# Altium project board2.PrjPcb
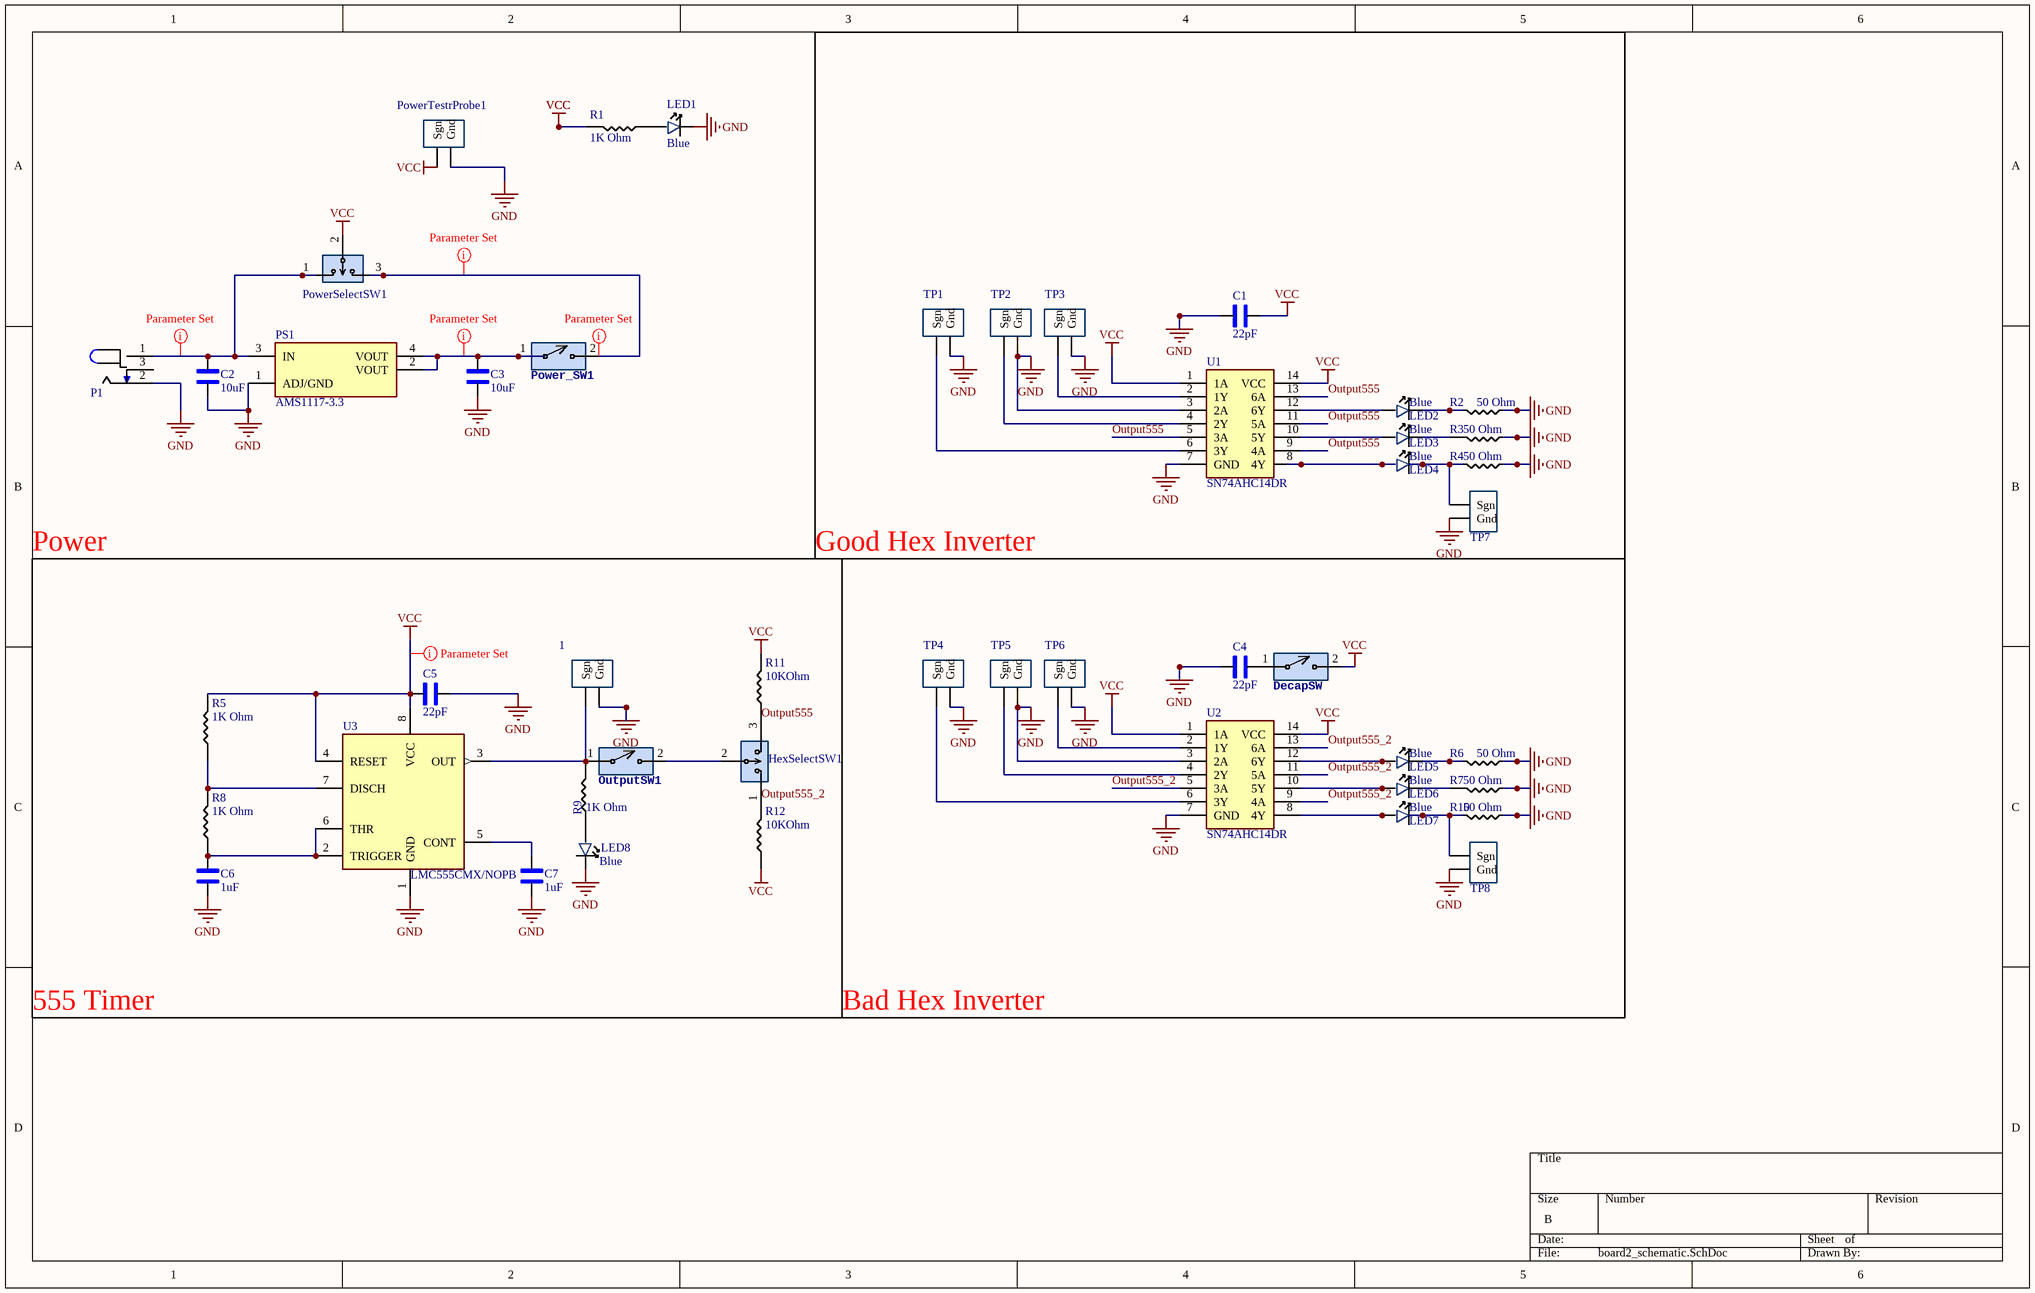
[diagram p0: board2_schematic.SchDoc]
1 sheet, 47 parts. Net scope: global (net labels, ports and power ports of the same name join across sheets).
Board file: board2_pcb.PcbDoc

## Sheet board2_schematic.SchDoc: Good/Bad Layout
size B; Author: Parth; CompanyName: CU boulder; DrawnBy: Parth; Revision: 1.0; SheetNumber: 1; SheetTotal: 1

### Parts
1  10x Probe TP  [TP10x_Probe]  (value not drawn)
C1  22pF  [1206_Passive_Capacitor]
C2  10uF  [1206_Passive_Capacitor]
C3  10uF  [1206_Passive_Capacitor]
C4  22pF  [1206_Passive_Capacitor]
C5  22pF  [1206_Passive_Capacitor]
C6  1uF  [1206_Passive_Capacitor]
C7  1uF  [1206_Passive_Capacitor]
DecapSW  SW_2Pin_100mil_Switch  [2Pin-Header-Conn]  (value not drawn)
HexSelectSW1  PREC003SAAN-RC  [3_PIN_100mil]  (value not drawn)
LED1  Blue  [LED_1206]
LED2  Blue  [LED_1206]
LED3  Blue  [LED_1206]
LED4  Blue  [LED_1206]
LED5  Blue  [LED_1206]
LED6  Blue  [LED_1206]
LED7  Blue  [LED_1206]
LED8  Blue  [LED_1206]
OutputSW1  SW_2Pin_100mil_Switch  [2Pin-Header-Conn]  (value not drawn)
P1  Power Jack  [Power_Jack]  (value not drawn)
Power_SW1  SW_2Pin_100mil_Switch  [2Pin-Header-Conn]  (value not drawn)
PowerSelectSW1  PREC003SAAN-RC  [3_PIN_100mil]  (value not drawn)
PowerTestrProbe1  10x Probe TP  [TP10x_Probe]  (value not drawn)
PS1  AMS1117-3.3  [LDO]
R1  value 1K Ohm  [1206_Passive_Resitor]  (hidden comment: 1k)
R2  value 50 Ohm  [1206_Passive_Resitor]  (hidden comment: 50R)
R3  value 50 Ohm  [1206_Passive_Resitor]  (hidden comment: 50R)
R4  value 50 Ohm  [1206_Passive_Resitor]  (hidden comment: 50R)
R5  value 1K Ohm  [1206_Passive_Resitor]  (hidden comment: 1k)
R6  value 50 Ohm  [1206_Passive_Resitor]  (hidden comment: 50R)
R7  value 50 Ohm  [1206_Passive_Resitor]  (hidden comment: 50R)
R8  value 1K Ohm  [1206_Passive_Resitor]  (hidden comment: 1k)
R9  value 1K Ohm  [1206_Passive_Resitor]  (hidden comment: 1k)
R10  value 50 Ohm  [1206_Passive_Resitor]  (hidden comment: 50R)
R11  value 10KOhm  [1206_Passive_Resitor]  (hidden comment: 10k)
R12  value 10KOhm  [1206_Passive_Resitor]  (hidden comment: 10k)
TP1  10x Probe TP  [TP10x_Probe]  (value not drawn)
TP2  10x Probe TP  [TP10x_Probe]  (value not drawn)
TP3  10x Probe TP  [TP10x_Probe]  (value not drawn)
TP4  10x Probe TP  [TP10x_Probe]  (value not drawn)
TP5  10x Probe TP  [TP10x_Probe]  (value not drawn)
TP6  10x Probe TP  [TP10x_Probe]  (value not drawn)
TP7  10x Probe TP  [TP10x_Probe]  (value not drawn)
TP8  10x Probe TP  [TP10x_Probe]  (value not drawn)
U1  SN74AHC14DR  [HEX_74AC14]
U2  SN74AHC14DR  [HEX_74AC14]
U3  LMC555CMX/NOPB  [TS555IDTTR]

### Nets
GND: 1.2(Gnd) C1.1 C2.1 C3.1 C4.1 C5.2 C6.1 C7.1 LED1.2 LED8.2 P1.2 PowerTestrProbe1.2(Gnd) PS1.1(ADJ/GND) R2.1 R3.1 R4.1 R6.1 R7.1 R10.1 TP1.2(Gnd) TP2.2(Gnd) TP3.2(Gnd) TP4.2(Gnd) TP5.2(Gnd) TP6.2(Gnd) TP7.2(Gnd) TP8.2(Gnd) U1.3(2A) U1.7(GND) U2.3(2A) U2.7(GND) U3.1(GND)
VCC: C1.2 C5.1 DecapSW.2 PowerSelectSW1.2 PowerTestrProbe1.1(Sgn) R1.2 R5.2 R11.2 R12.1 U1.1(1A) U1.14(VCC) U2.1(1A) U2.14(VCC) U3.4(RESET) U3.8(VCC)
Output555: HexSelectSW1.3 R11.1 U1.5(3A) U1.9(4A) U1.11(5A) U1.13(6A)
Output555_2: HexSelectSW1.1 R12.2 U2.5(3A) U2.9(4A) U2.11(5A) U2.13(6A)
Net1_1: 1.1(Sgn) OutputSW1.1 R9.2 U3.3(OUT)
NetC2_2: C2.2 P1.1 PowerSelectSW1.1 PS1.3(IN)
NetC3_2: C3.2 Power_SW1.1 PS1.2(VOUT) PS1.4(VOUT)
NetC4_2: C4.2 DecapSW.1
NetC6_2: C6.2 R8.1 U3.2(TRIGGER) U3.6(THR)
NetC7_2: C7.2 U3.5(CONT)
NetHexSelectSW1_2: HexSelectSW1.2 OutputSW1.2
NetLED1_1: LED1.1 R1.1
NetLED2_1: LED2.1 U1.12(6Y)
NetLED2_2: LED2.2 R2.2
NetLED3_1: LED3.1 U1.10(5Y)
NetLED3_2: LED3.2 R3.2
NetLED4_1: LED4.1 U1.8(4Y)
NetLED4_2: LED4.2 R4.2 TP7.1(Sgn)
NetLED5_1: LED5.1 U2.12(6Y)
NetLED5_2: LED5.2 R6.2
NetLED6_1: LED6.1 U2.10(5Y)
NetLED6_2: LED6.2 R7.2
NetLED7_1: LED7.1 U2.8(4Y)
NetLED7_2: LED7.2 R10.2 TP8.1(Sgn)
NetLED8_1: LED8.1 R9.1
NetPower_SW1_2: Power_SW1.2 PowerSelectSW1.3
NetR5_1: R5.1 R8.2 U3.7(DISCH)
NetTP1_1: TP1.1(Sgn) U1.6(3Y)
NetTP2_1: TP2.1(Sgn) U1.4(2Y)
NetTP3_1: TP3.1(Sgn) U1.2(1Y)
NetTP4_1: TP4.1(Sgn) U2.6(3Y)
NetTP5_1: TP5.1(Sgn) U2.4(2Y)
NetTP6_1: TP6.1(Sgn) U2.2(1Y)

Not connected (* = marked no-connect by the designer): P1 3

### Layout directives
rule Width Constraint [Pref Width = 20mil    Min Width = 10mil    Max Width = 30mil]: NetC2_2, NetC3_2, NetPower_SW1_2, VCC

### Notes on the sheet
- Power
- Good Hex Inverter
- 555 Timer
- Bad Hex Inverter

### Library data of the parts
1 PowerTestrProbe1 TP1-TP8 = TP_10x_Probe: Test Point 300 mil centers
C1 C4 C5 = C_22pF_1206: 22pF ±5% 1kV C0G 1206 Multilayer Ceramic Capacitors MLCC - SMD/SMT RoHS; MFR Part #: CC1206JKNPOCBN220; Type: Extended; LCSC Part#: C107174; Datasheet: https://datasheet.lcsc.com/lcsc/1810241219_YAGEO-CC1206JKNPOCBN220_C107174.pdf; Value: 22pF
C2 C3 = C_10uF_1206: 10uF ±10% 50V X5R 1206 Multilayer Ceramic Capacitors MLCC - SMD/SMT RoHS; MFR Part #: CL31A106KBHNNNE; Type: Basic; LCSC Part#: C13585; Datasheet: https://datasheet.lcsc.com/lcsc/1810221112_Samsung-Electro-Mechanics-CL31A106KBHNNNE_C13585.pdf; Value: 10uF
C6 C7 = C_1uF_1206: MULTILAYER CERAMIC CAPACITORS MLCC - SMD/SMT 1UF 50V 1206 ROHS; MFR Part #: CL31B105KBHNNNE; Type: Basic; Digikey Link: https://www.digikey.com/product-detail/en/C1206C105M4RACTU/399-8150-1-ND/3471873/?itemSeq=304982366; LCSC Part#: C1848; Value: 1uF
DecapSW OutputSW1 Power_SW1 = SW_2Pin_100mil_Switch: 2Pin Header; LCSC Part#: C124375; Type: Extended
HexSelectSW1 PowerSelectSW1 = SW_3Pin_100mil_Switch: Connector Header Through Hole 3 position 0.100" (2.54mm); Value: CONN HEADER VERT 3POS 2.54MM; Digikey Link: https://www.digikey.com/product-detail/en/PREC003SAAN-RC/S1012EC-03-ND/2774851/?itemSeq=304982371; MFR Part #: PREC003SAAN-RC; Type: Extended; LCSC Part#: C49257
LED1-LED8 = LED_BLUE_1206: blue 1206  Light Emitting Diodes (LED) ROHS; MFR Part #: NCD1206B1; Type: Extended; LCSC Part#: C130717; Datasheet: https://datasheet.lcsc.com/lcsc/2008201033_Foshan-NationStar-Optoelectronics-NCD1206B1_C130717.pdf; Value: Blue
P1 = P_Power Jack: Power Barrel Connector Jack 2.10mm ID (0.083"), 5.50mm OD (0.217") Through Hole, Right Angle; MFR Part #: PJ-102A; Value: CONN PWR JACK 2X5.5MM SOLDER; Digikey Link: https://www.digikey.com/product-detail/en/PJ-102A/CP-102A-ND/275425/?itemSeq=304982367; LCSC Part#: C136744; Type: Extended
PS1 = PS_AMS_LDO_3v3: LOW DROPOUT REGULATORS(LDO) POSITIVE FIXED 1.3V @ 800MA 15V 3.3V 1A SOT-223 ROHS; Value: IC REG LINEAR 3.3V 800MA SOT223; MFR Part #: AMS1117-3.3; LCSC Part#: C6186; Type: Basic
R1 R5 R8 R9 = R_1K_1206: CHIP RESISTOR - SURFACE MOUNT 1KOHMS ±1% 1/4W 1206 ROHS; MFR Part #: RNCP1206FTD1K00CT; Digikey Link: https://www.digikey.com/product-detail/en/RNCP1206FTD1K00/RNCP1206FTD1K00CT-ND/2240675/?itemSeq=304982373; LCSC Part#: C4410; Type: Basic
R2-R4 R6 R7 R10 = R_1K_1206: CHIP RESISTOR - SURFACE MOUNT 50OHMS ±1% 1/4W 1206 ROHS; MFR Part #: RNCP1206FTD1K00CT; Digikey Link: https://www.digikey.com/product-detail/en/RNCP1206FTD1K00/RNCP1206FTD1K00CT-ND/2240675/?itemSeq=304982373; LCSC Part#: C4410; Type: Basic
R11 R12 = R_10KOhm_1206: 10 kOhms ±5% 0.25W, 1/4W Chip Resistor 1206 (3216 Metric) Automotive AEC-Q200 Thick Film; MFR Part #: RMCF1206FT10K0; Digikey Link: https://www.digikey.com/en/products/detail/stackpole-electronics-inc/RMCF1206FT10K0/1759669; LCSC Part#: C17902; Type: Basic
U1 U2 = U_74AHC14: Inverter IC 6 Channel Schmitt Trigger 14-SOIC; Datasheet: https://datasheet.lcsc.com/szlcsc/ON-Semicon-ON-74AC14SCX_C5482.pdf; MFR Part #: SN74AHC14DR; LCSC Part#: C6942; Type: Extended
U3 = U_555_Fast: 555 Type, Timer/Oscillator _Single_ IC 3MHz 8-SO; Package: SOIC-8; MFR Part #: LMC555CMX/NOPB; DigiKey link: https://www.digikey.com/product-detail/en/texas-instruments/LMC555CMX-NOPB/LMC555CMX-NOPBCT-ND/1010550; LCSC Part#: C90760; Type: Extended